# EAGLE schematic driver (EAGLE 6.5.0)
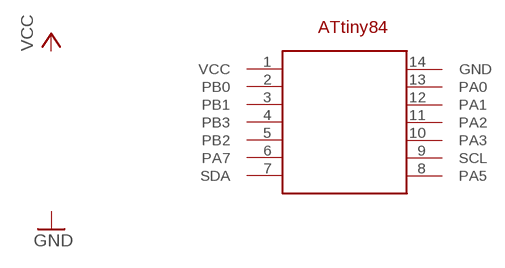
[diagram p0: schematic, sheet 1]

## Parts
U$1  TINY84SO14  [SO14]
Unconnected: U$1.2(PB0) U$1.3(PB1) U$1.4(PB3) U$1.5(PB2) U$1.6(PA7) U$1.7(SDA) U$1.8(PA5) U$1.9(SCL) U$1.10(PA3) U$1.11(PA2) U$1.12(PA1) U$1.13(PA0)

## Power pins joined to a net without a drawn wire
GND: U$1.14(GND)
VCC: U$1.1(VCC)

## Library data of the parts
U$1 = atmel:TINY84: ATTINY 84 soic-14